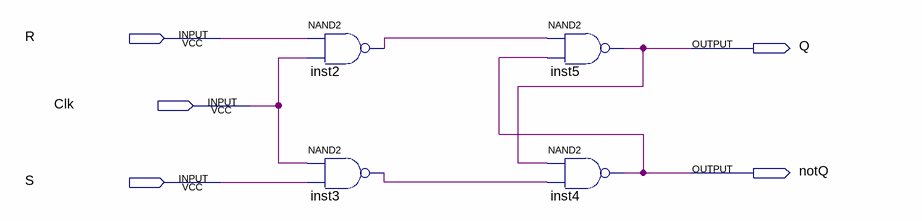
[diagram p0: schematic sheet]
// Quartus schematic SR_latch_clocked_block.bdf as structural Verilog: 4 symbols, 5 pins
module SR_latch_clocked_block (
  input  R,
  input  Clk,
  input  S,
  output Q,
  output notQ
);

  wire inst2_out, inst3_out;

  nand inst2 (inst2_out, R, Clk);
  nand inst3 (inst3_out, Clk, S);
  nand inst5 (Q, inst2_out, notQ);
  nand inst4 (notQ, Q, inst3_out);
endmodule
